# EAGLE design rtc (EAGLE 9.6.2)
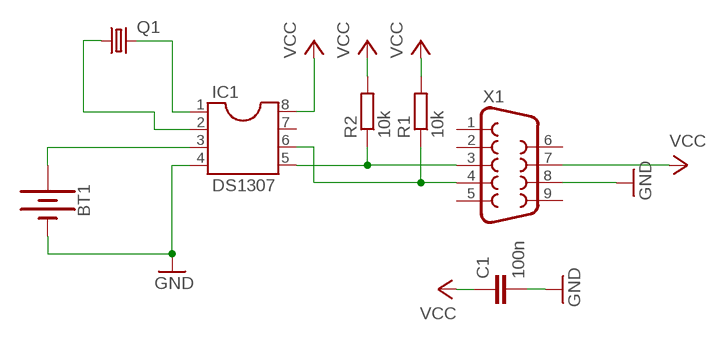
[diagram p0: schematic, sheet 1]

## Parts
BT1  BATTERY-20MM_PTH  [BATTCOM_20MM_PTH]
C1  100n  C-EU025-025X050  [C025-025X050]
IC1  DS1307  DIL8  [DIL08]
Q1  CRYSTALTC26V  [TC26V]
R1  10k  R-EU_0204/7  [0204/7]
R2  10k  R-EU_0204/7  [0204/7]
X1  F09D  [F09D]

## Nets
GND: BT1.2(-) C1.2 IC1.4 X1.8
N$1: IC1.5 R2.1 X1.3
N$2: IC1.6 R1.1 X1.4
N$3: BT1.1(+) IC1.3
N$4: IC1.2 Q1.1
N$5: IC1.1 Q1.2
VCC [wide]: C1.1 IC1.8 R1.2 R2.2 X1.7
Unconnected: IC1.7 X1.1 X1.2 X1.5 X1.6 X1.9

## Library data of the parts
BT1 = SparkFun-Batteries:BATTERY: Battery - Single Cell A variety of battery chemistries, sizes, and footprints. Device List: 20MM_PTH - Coin Cell Battery Holder - 20mm (PTH) <https://www.sparkfun.com/products/783> 20MM_PTH_KIT- Coin Cell battery Holder - 20 mm (PTH) <http://www.sparkfun.com/products/783>kit version with special mask 6.8MM_PTH - Coin Cell Battery Holder - 6.8MM(SMD) <https://www.digikey.com/product-detail/en/seiko-instruments/MS621FE-FL11E/728-1057-ND/1889208?WT.srch=1&gclid=CNOQ5a6LzdQCFZS2wAodXCkE0g> 12MM_SMD - Coin Cell Battery Holder - 12mm (SMD) <https://www.sparkfun.com/products/10592> 12MM_PTH - Coin Cell Battery Holder - 12mm (PTH) <https://www.sparkfun.com/products/7948> 20MM_SMD - 20mm Coin Cell Battery Holder (SMD) (2 legs) Used on the Big Time Watch Kit <https://www.sparkfun.com/products/11734> 20MM_SMD_4LEGS - Coin Cell Battery Holder - 20mm (SMD) <https://www.sparkfun.com/products/11892> 20MM_SMD_4LEGS_OVERPASTE - Coin Cell Battery Holder - 20mm (SMD) <https://www.sparkfun.com/products/11892> (Over-paste on the legs) 24.5MM_PTH - Coin Cell Battery Holder - 24.5mm (PTH) <https://www.sparkfun.com/products/8863> 9V - 9V Battery Holder - PC Mount Used on the SparkFun SparkPunk Sound Kit <https://www.sparkfun.com/products/11177> and SparkFun SparkPunk Sequencer Kit <https://www.sparkfun.com/products/12707> 18650 - Battery Holder - 18650 (PTH) <https://www.sparkfun.com/products/13113> AA - Battery Holder - 1xAA (PTH) <https://www.sparkfun.com/products/7949> AAA - Battery Holder - 1xAAA (PTH) <https://www.sparkfun.com/products/12718> AA_KIT - Battery Holder - 1xAA (PTH) <https://www.sparkfun.com/products/7949> Special kit package - pads only have exposed copper on one side of the board. AAA_KIT - Battery Holder - 1xAAA (PTH) <https://www.sparkfun.com/products/12718> Special kit package - pads only have exposed copper on one side of the board.; PROD_ID: BATT-09031; SF_SKU: PRT-00783
C1 = rcl:C-EU: CAPACITOR, European symbol; SPICEPREFIX: C
IC1 = ic-package:DIL8: Dual In Line / Socket
Q1 = crystal:CRYSTAL: CRYSTAL; OC_FARNELL: unknown; OC_NEWARK: unknown
R1 R2 = rcl:R-EU_: RESISTOR, European symbol; SPICEPREFIX: R
X1 = con-subd:F09: SUB-D; OC_FARNELL: unknown; OC_NEWARK: unknown

## Net classes
1 wide: width 0.508 mm

## Board
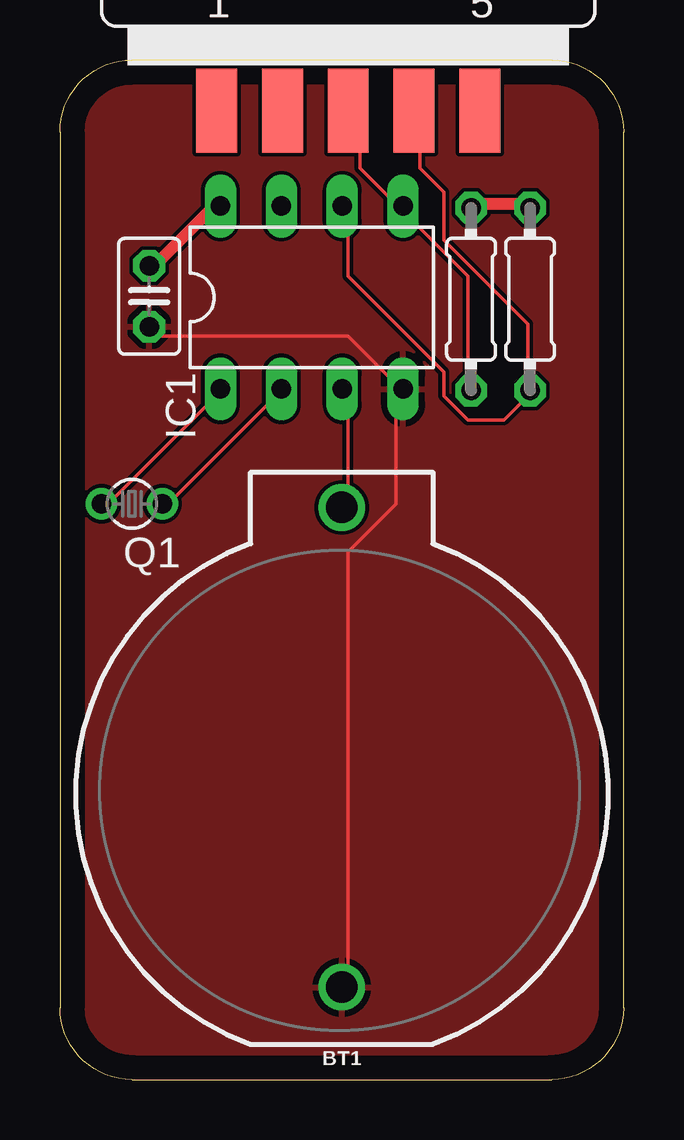
[diagram p1: board, top side]
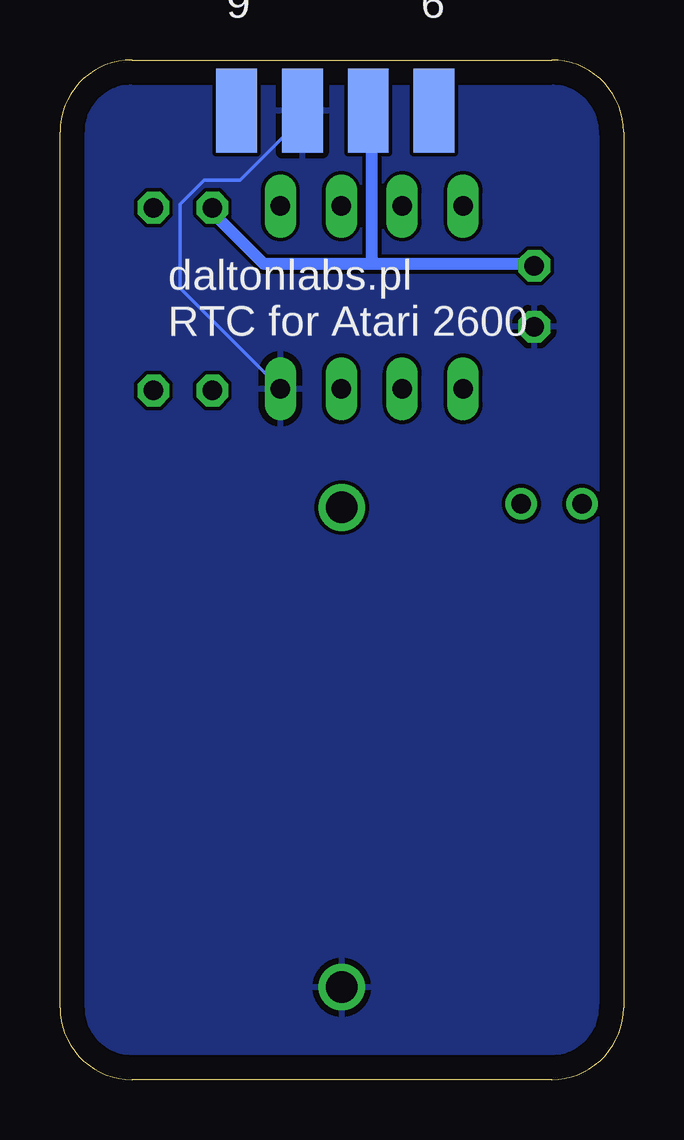
[diagram p2: board, bottom side, seen from below]

Size 23.5 x 42.5 mm. Coordinates in mm from the lower left corner, seen from the top.
Outline: 3,0 20.5,0 arc90 23.5,3 23.5,39.5 arc90 20.5,42.5 3,42.5 arc90 0,39.5 0,3 arc90 3,0
Copper layers (1*16): Top 0.035mm / dielectric 1.5mm / Bottom 0.035mm
Design rules "default": minimum track width 6mil, minimum drill 0.35mm, track to track 6mil, track to pad 6mil, pad to pad 6mil, via to via 6mil, smd to smd 6mil, copper to edge 40mil, drill to drill 6mil, minimum pad ring 10mil, minimum via ring 8mil, stop-mask expansion 4mil, vias tented up to drill 0mil, thermal gap 10mil

### Footprints (pad centres in the part's own frame; a part is rotated, then mirrored left to right if it is on the bottom)
BATTCOM_20MM_PTH = drill 1.3: 1 11.85,0; 2 -8.15,0
C025-025X050 = drill 0.813 octagon: 1 -1.27,0; 2 1.27,0
DIL08 = drill 0.813 long: 1 -3.81,-3.81; 2 -1.27,-3.81; 3 1.27,-3.81; 4 3.81,-3.81; 5 3.81,3.81; 6 1.27,3.81; 7 -1.27,3.81; 8 -3.81,3.81
TC26V = drill 0.813: 1 -1.27,0; 2 1.27,0
0204/7 = drill 0.813 octagon: 1 -3.81,0; 2 3.81,0
F09D = smd 1.7 x 3.5: 1 -5.486,-6.045; 2 -2.743,-6.045; 3 0,-6.045; 4 2.743,-6.045; 5 5.486,-6.045 | smd 1.7 x 3.5 bottom: 6 -4.115,-6.045; 7 -1.372,-6.045; 8 1.372,-6.045; 9 4.115,-6.045

### Placement (x,y rotation side)
BT1  11.75,12 90 top
C1  3.72,32.65 270 top
IC1  10.5,32.6 0 top
Q1  3,24 180 top
R1  19.6,32.53 90 top
R2  17.14,32.53 90 top
X1  12.02,46.44 0 top

### Tracks (layer width: path | path; a pad name or v marks a point on that pad's centre or on a via)
GND
  Top 0.152: C1.2 4,31 12,31 14,29 IC1.4 14,28.5 14,24 12,22 12,4 BT1.2
  Bottom 0.152: X1.8 13.5,40 16,37.5 17.5,37.5 18.5,36.5 18.5,33 14.5,29 IC1.4
  pour Top: -6.5,43.5 29,43.5 29,0 -6.5,0
  pour Bottom: -5.5,43.5 30,43.5 30,-0.5 -6,-0.5 -6,43
N$1
  Top 0.152: R2.1 17,29 17,33.5 14.5,36 IC1.5 14,36.5 12.5,38 12.5,40 X1.3
N$2
  Top 0.152: IC1.6 12,36 12,33.5 16,29.5 16,28.5 17,27.5 18.5,27.5 19.5,28.5 R1.1 19.5,29 19.5,31.5 16,35 16,37 15,38 15,40 X1.4
N$3
  Top 0.152: IC1.3 12,28.5 12,24 BT1.1
N$4
  Top 0.152: Q1.1 4.5,24 9,28.5 IC1.2
N$5
  Top 0.152: Q1.2 2,24 6.5,28.5 IC1.1
VCC
  Top 0.508: R2.2 17.5,36.5 19.5,36.5 R1.2 | C1.1 4,34 6.5,36.5 IC1.8
  Bottom 0.508: 10.5,34 4,34 C1.1 | 10.5,34 15,34 17,36 R2.2 | 10.5,34 10.5,40 X1.7

### Text on the board
bNames: daltonlabs.pl / RTC for Atari 2600